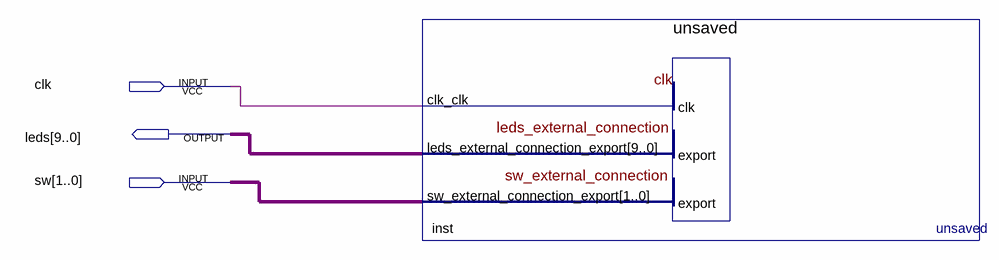
[diagram p0: schematic sheet]
// Quartus schematic Interrupciones.bdf as structural Verilog: 1 symbols, 3 pins
module Interrupciones (
  input  clk,
  input  [1:0] sw,
  output [9:0] leds
);

  unsaved inst (.clk_clk(clk), .sw_external_connection_export(sw), .leds_external_connection_export(leds));
endmodule
